# Altium project A6_FRONTPANELv3.PrjPcb
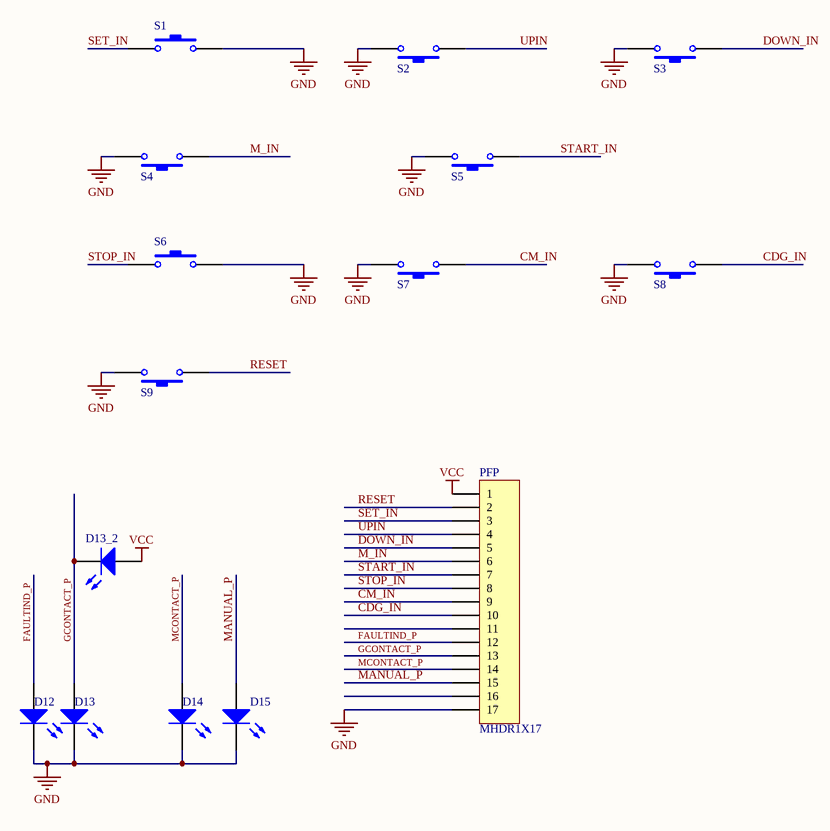
[diagram p0: FRONTPANEL.SchDoc]
1 sheet, 15 parts. Net scope: global (net labels, ports and power ports of the same name join across sheets).
Board file: A6.PcbDoc

## Sheet FRONTPANEL.SchDoc
size A4

### Parts
D12  RED LED 3MM  [LEDSMALL]  (value not drawn)
D13  GREEN LED 3MM  [LEDSMALL]  (value not drawn)
D13_2  GREEN LED 3MM  [LEDSMALL]  (value not drawn)
D14  GREEN LED 3MM  [LEDSMALL]  (value not drawn)
D15  YELLOW LED 3MM  [LEDSMALL]  (value not drawn)
PFP  MHDR1X17  [HDR1X17_BURGE_M_ST]
S1  8MM DOM SWITCH  [DOMKEY8MM]  (value not drawn)
S2  8MM DOM SWITCH  [DOMKEY8MM]  (value not drawn)
S3  8MM DOM SWITCH  [DOMKEY8MM]  (value not drawn)
S4  8MM DOM SWITCH  [DOMKEY8MM]  (value not drawn)
S5  8MM DOM SWITCH  [DOMKEY8MM]  (value not drawn)
S6  8MM DOM SWITCH  [DOMKEY8MM]  (value not drawn)
S7  8MM DOM SWITCH  [DOMKEY8MM]  (value not drawn)
S8  8MM DOM SWITCH  [DOMKEY8MM]  (value not drawn)
S9  8MM DOM SWITCH  [DOMKEY8MM]  (value not drawn)

### Nets
GND: D12.2(K) D13.2(K) D14.2(K) D15.2(K) PFP.17 S1.2 S2.2 S3.2 S4.2 S5.2 S6.2 S7.2 S8.2 S9.2
VCC: D13_2.1(A) PFP.1
CDG_IN: PFP.10 S8.1
CM_IN: PFP.9 S7.1
DOWN_IN: PFP.5 S3.1
FAULTIND_P: D12.1(A) PFP.12
GCONTACT_P: D13.1(A) D13_2.2(K) PFP.13
M_IN: PFP.6 S4.1
MANUAL_P: D15.1(A) PFP.15
MCONTACT_P: D14.1(A) PFP.14
RESET: PFP.2 S9.1
SET_IN: PFP.3 S1.1
START_IN: PFP.7 S5.1
STOP_IN: PFP.8 S6.1
UPIN: PFP.4 S2.1

Not connected (* = marked no-connect by the designer): PFP 11 16

### Notes on the sheet
- Title
- Size:
- A4
- Number:
- Revision:
- Simcons Control Systems
- Kalamassery
- Cochin
- India
- Date:
- Drawn By:
- SURAJ K A
- Sheet
- of

### Library data of the parts
D12 D13 D13_2 D14 D15 = LED1: 3mm LED; Published: 8-Jun-2000; LatestRevisionDate: 08-Jul-2005; LatestRevisionNote: Mech Layer 1 removed.; PackageReference: LED-1; Publisher: Altium Limited; PackageDescription: LED; 2 Leads
PFP = MHDR1X17: Header, 17-Pin; LatestRevisionDate: 17-Jul-2002; LatestRevisionNote: Re-released for DXP Platform.; Publisher: Altium Limited
S1-S9 = SW-PB: Switch; Published: 24-Mar-1999; LatestRevisionDate: 17-Jul-2002; LatestRevisionNote: Re-released for DXP Platform.; PackageReference: SPST-2; Publisher: Altium Limited; PackageDescription: Switch; 2 Leads